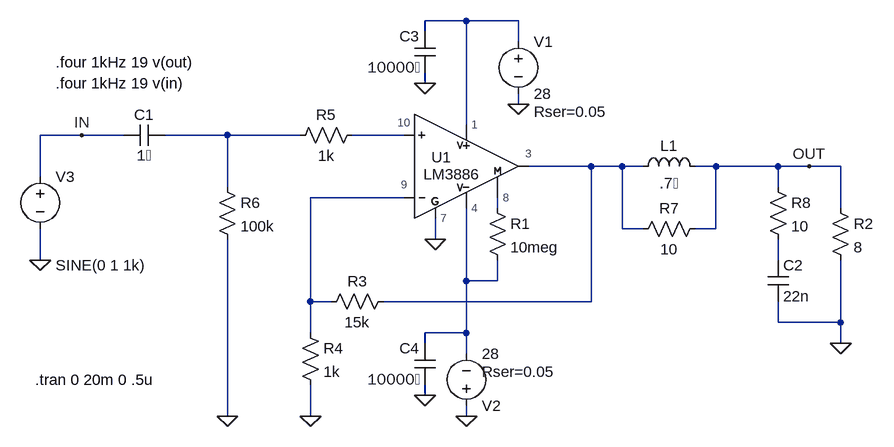
[diagram p0: schematic LM3886 Example.asc]
LM3886 Example.asc, the LTspice schematic file:
Version 4
SHEET 1 880 712
WIRE 208 0 144 0
WIRE 288 0 208 0
WIRE 144 16 144 0
WIRE 288 32 288 0
WIRE 144 96 144 80
WIRE 288 128 288 112
WIRE 208 160 208 0
WIRE -384 176 -448 176
WIRE -320 176 -384 176
WIRE -160 176 -256 176
WIRE -48 176 -160 176
WIRE 112 176 32 176
WIRE 400 224 304 224
WIRE 448 224 400 224
WIRE 480 224 448 224
WIRE 592 224 560 224
WIRE 688 224 592 224
WIRE 736 224 688 224
WIRE 784 224 736 224
WIRE -448 240 -448 176
WIRE -160 256 -160 176
WIRE 688 256 688 224
WIRE 112 272 -32 272
WIRE 256 288 256 272
WIRE 784 288 784 224
WIRE 448 320 448 224
WIRE 480 320 448 320
WIRE 592 320 592 224
WIRE 592 320 560 320
WIRE 160 336 160 304
WIRE -448 368 -448 320
WIRE 688 368 688 336
WIRE 208 400 208 288
WIRE 256 400 256 368
WIRE 256 400 208 400
WIRE -32 432 -32 272
WIRE 0 432 -32 432
WIRE 400 432 400 224
WIRE 400 432 80 432
WIRE 688 464 688 432
WIRE 784 464 784 368
WIRE 784 464 688 464
WIRE -32 480 -32 432
WIRE 208 480 208 400
WIRE 208 480 144 480
WIRE 144 496 144 480
WIRE 784 496 784 464
WIRE 208 512 208 480
WIRE 144 576 144 560
WIRE -160 608 -160 336
WIRE -32 608 -32 560
WIRE 208 608 208 592
FLAG 208 608 0
FLAG 288 128 0
FLAG 160 336 0
FLAG 784 496 0
FLAG -32 608 0
FLAG -448 368 0
FLAG -160 608 0
FLAG 144 96 0
FLAG 144 576 0
FLAG 736 224 OUT
FLAG -384 176 IN
SYMBOL voltage 288 16 R0
WINDOW 123 0 0 Left 2
WINDOW 39 24 124 Left 2
SYMATTR SpiceLine Rser=0.05
SYMATTR InstName V1
SYMATTR Value 28
SYMBOL voltage 208 608 M180
WINDOW 123 0 0 Left 2
WINDOW 39 24 68 Left 2
SYMATTR SpiceLine Rser=0.05
SYMATTR InstName V2
SYMATTR Value 28
SYMBOL res 240 272 R0
SYMATTR InstName R1
SYMATTR Value 10meg
SYMBOL res 768 272 R0
SYMATTR InstName R2
SYMATTR Value 8
SYMBOL res 96 416 R90
WINDOW 0 0 56 VBottom 2
WINDOW 3 32 56 VTop 2
SYMATTR InstName R3
SYMATTR Value 15k
SYMBOL res -48 464 R0
SYMATTR InstName R4
SYMATTR Value 1k
SYMBOL res 48 160 R90
WINDOW 0 0 56 VBottom 2
WINDOW 3 32 56 VTop 2
SYMATTR InstName R5
SYMATTR Value 1k
SYMBOL cap -256 160 R90
WINDOW 0 0 32 VBottom 2
WINDOW 3 32 32 VTop 2
SYMATTR InstName C1
SYMATTR Value 1�
SYMBOL res -176 240 R0
SYMATTR InstName R6
SYMATTR Value 100k
SYMBOL voltage -448 224 R0
WINDOW 3 24 152 Left 2
WINDOW 39 0 0 Left 2
SYMATTR Value SINE(0 1 1k)
SYMATTR InstName V3
SYMBOL LM3886 176 160 R0
SYMATTR InstName U1
SYMBOL ind 464 240 R270
WINDOW 0 32 56 VTop 2
WINDOW 3 5 56 VBottom 2
SYMATTR InstName L1
SYMATTR Value .7�
SYMATTR SpiceLine Rser=.01
SYMBOL res 576 304 R90
WINDOW 0 0 56 VBottom 2
WINDOW 3 32 56 VTop 2
SYMATTR InstName R7
SYMATTR Value 10
SYMBOL res 672 240 R0
SYMATTR InstName R8
SYMATTR Value 10
SYMBOL cap 672 368 R0
SYMATTR InstName C2
SYMATTR Value 22n
SYMBOL cap 160 16 M0
SYMATTR InstName C3
SYMATTR Value 10000�
SYMATTR SpiceLine Rser=0.02
SYMBOL cap 160 496 M0
SYMATTR InstName C4
SYMATTR Value 10000�
SYMATTR SpiceLine Rser=0.02
TEXT -456 552 Left 2 !.tran 0 20m 0 .5u
TEXT -424 64 Left 2 !.four 1kHz 19 v(out)
TEXT -424 96 Left 2 !.four 1kHz 19 v(in)

The netlist it stands for:
* LM3886 Example.asc
V1 N001 0 28 Rser=0.05
V2 0 N008 28 Rser=0.05
R1 N006 N008 10meg
R2 OUT 0 8
R3 N004 N005 15k
R4 N005 0 1k
R5 N003 N002 1k
C1 N002 IN 1�
R6 N002 0 100k
V3 IN 0 SINE(0 1 1k)
XU1 N003 N005 N001 N008 0 N004 N006 LM3886  ; pins 10 9 1 4 7 3 8
L1 N004 OUT .7� Rser=.01
R7 OUT N004 10
R8 OUT N007 10
C2 N007 0 22n
C3 N001 0 10000� Rser=0.02
C4 N008 0 10000� Rser=0.02
.tran 0 20m 0 .5u
.four 1kHz 19 v(out)
.four 1kHz 19 v(in)
.lib LM3886.lib
.backanno
.end